# EAGLE design MRCS-Off-Hook-Detector (EAGLE 7.7.0)
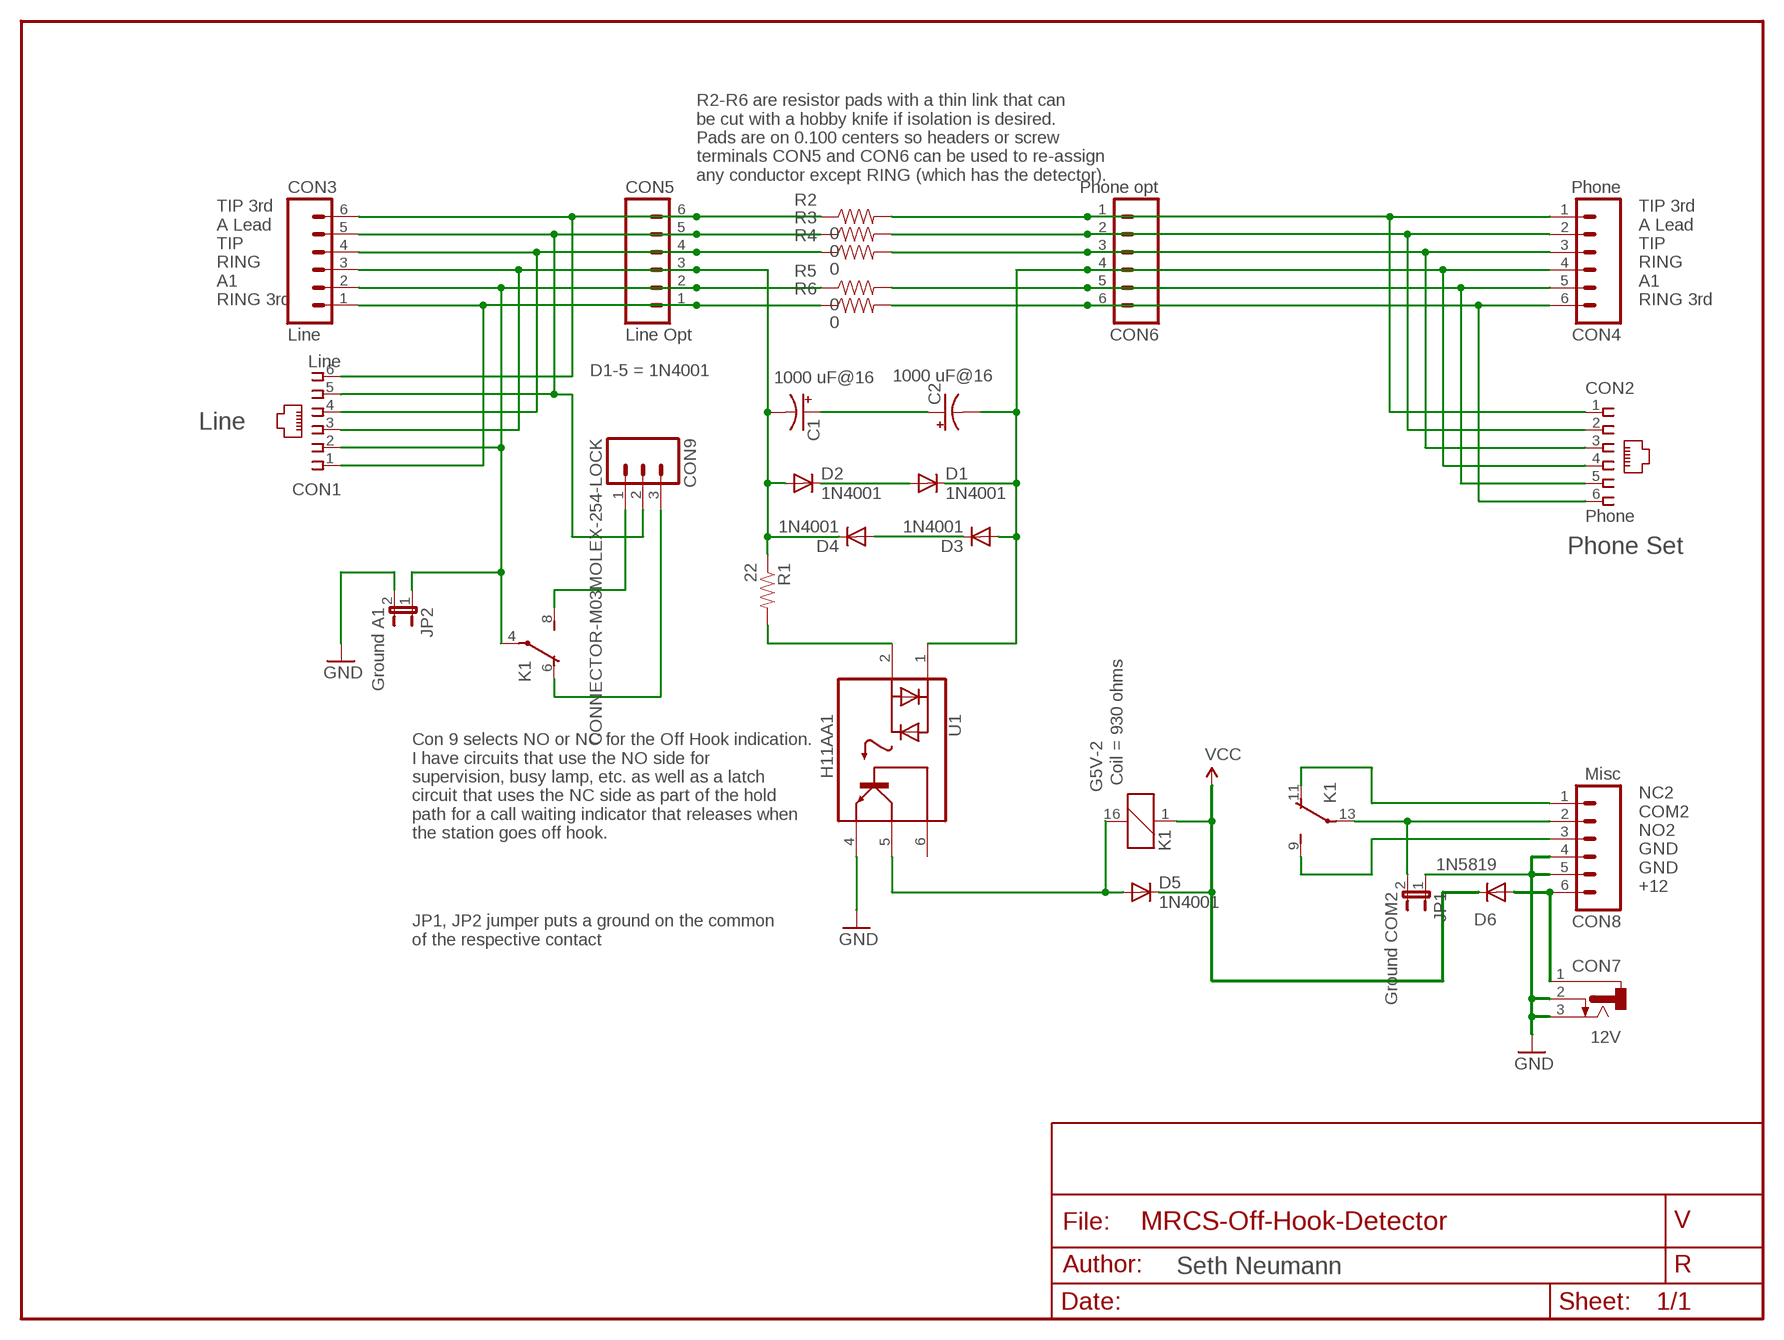
[diagram p0: schematic, sheet 1]

## Parts
C1  1000 uF@16  CPOL-USE3.5-8  [E3,5-8]
C2  1000 uF@16  CPOL-USE3.5-8  [E3,5-8]
CON1  Line  CONNECTOR-RJ25-43860-2-MOLEX  [RJ25-INVERTED]
CON2  Phone  CONNECTOR-RJ25-43860-2-MOLEX  [RJ25-INVERTED]
CON3  Line  CONNECTOR-M06LOCK  [1X06_LOCK]
CON4  Phone  CONNECTOR-M06LOCK  [1X06_LOCK]
CON5  Line Opt  CONNECTOR-M06LOCK  [1X06_LOCK]
CON6  Phone opt  CONNECTOR-M06LOCK  [1X06_LOCK]
CON7  12V  CONNECTOR-DC-POWER-RA  [DCJ0202]
CON8  Misc  CONNECTOR-M06LOCK  [1X06_LOCK]
CON9  CONNECTOR-M03MOLEX-254-LOCK  [MOLEX-1X3_LOCK]
D1  1N4001  DIODEPTH  [DIODE-1N4001]
D2  1N4001  DIODEPTH  [DIODE-1N4001]
D3  1N4001  DIODEPTH  [DIODE-1N4001]
D4  1N4001  DIODEPTH  [DIODE-1N4001]
D5  1N4001  DIODEPTH  [DIODE-1N4001]
D6  1N5819  DIODEPTH  [DIODE-1N4001]
JP1  Ground COM2  JUMPER-2PTH  [1X02]
JP2  Ground A1  JUMPER-2PTH  [1X02]
K1  G5V-2  [G5V-2]
R1  22  RPTH04  [AXIAL-0.4-RES]
R2  0  RPTH-R0  [CUT-R]
R3  0  RPTH-R0  [CUT-R]
R4  0  RPTH-R0  [CUT-R]
R5  0  RPTH-R0  [CUT-R]
R6  0  RPTH-R0  [CUT-R]
U1  H11AA1  [DIP762W50P254L730H410Q6]

## Nets
3RL [Phone]: CON1.1 CON3.1 CON5.1 R6.P2
3RS [Phone]: CON2.6 CON4.6 CON6.6 R6.P1
3TL [Phone]: CON1.6 CON3.6 CON5.6 R2.P2
3TS [Phone]: CON2.1 CON4.1 CON6.1 R2.P1
+12 [Power]: CON7.1 CON8.6 D6.A
A1_LINE [Phone]: CON1.2 CON3.2 CON5.2 JP2.1 K1.4(1:P) R5.P2
A1_PHONE: CON2.5 CON4.5 CON6.5 R5.P1
A_LINE [Phone]: CON1.5 CON3.5 CON5.5 CON9.2 R3.P2
A_PHONE [Phone]: CON2.2 CON4.2 CON6.2 R3.P1
GND: CON7.2 CON7.3 CON8.4 CON8.5 JP1.1 JP2.2 U1.4(E)
N$1: D5.A K1.16 U1.5(C)
N$2: R1.P$2 U1.2(C/A)
N$3: CON8.1 K1.11(2:O)
N$4: D1.A D2.C
N$5: C1.+ C2.+
N$6: D3.C D4.A
N$7: CON9.1 K1.8(1:S)
N$9: CON9.3 K1.6(1:O)
N$15: CON8.2 JP1.2 K1.13(2:P)
N$16: CON8.3 K1.9(2:S)
RING-PHONE [Phone]: C2.- CON2.4 CON4.4 CON6.4 D1.C D3.A U1.1(A/C)
RING_LINE: C1.- CON1.3 CON3.3 CON5.3 D2.A D4.C R1.P$1
TIP_LINE [Phone]: CON1.4 CON3.4 CON5.4 R4.P2
TIP_PHONE: CON2.3 CON4.3 CON6.3 R4.P1
VCC [Power]: D5.C D6.C K1.1
Unconnected: U1.6(B)

## Notes on the sheet
- R2-R6 are resistor pads with a thin link that can 
  be cut with a hobby knife if isolation is desired. 
  Pads are on 0.100 centers so headers or screw
  terminals CON5 and CON6 can be used to re-assign
  any conductor except RING (which has the detector).
- TIP 3rd
  A Lead
  TIP
  RING
  A1
  RING 3rd
- TIP 3rd
  A Lead
  TIP
  RING
  A1
  RING 3rd
- D1-5 = 1N4001
- Line
- Phone Set
- Coil = 930 ohms
- Con 9 selects NO or NC for the Off Hook indication. 
  I have circuits that use the NO side for
  supervision, busy lamp, etc. as well as a latch
  circuit that uses the NC side as part of the hold 
  path for a call waiting indicator that releases when
  the station goes off hook.
- NC2
  COM2
  NO2
  GND
  GND
  +12
- JP1, JP2 jumper puts a ground on the common
  of the respective contact
- Seth Neumann

## Library data of the parts
C1 C2 = rcl:CPOL-US: POLARIZED CAPACITOR, American symbol
CON1 CON2 = SPCoast:CONNECTOR-RJ25: AMP connector
CON3-CON6 CON8 = SPCoast:CONNECTOR-M06: Header 6 Standard 6-pin 0.1" header
CON7 = SPCoast:CONNECTOR-DC-POWER: DC POWER JACK
CON9 = SPCoast:CONNECTOR-M03
D1-D6 = SPCoast:DIODE: Diode These are standard reverse protection diodes and small signal diodes. SMA package can handle up to about 1A. SOD-323 can handle about 200mA. What the SOD-323 package when ordering, there are some mfgs out there that are 5-pin packages.
JP1 JP2 = SPCoast:JUMPER-2: Jumper Basic 0.1" spaced jumper. Use with breakaway headers.
K1 = relay:G5V-2: OMRON PCB Relay Source: http://www.omron.com/ecb/products/pdf/en-g5v2.pdf; MPN: G5V-2 5DC; OC_FARNELL: 9949488; OC_NEWARK: 78K5703
R1-R6 = SPCoast:R*: Resistor Basic schematic elements and footprints for 0603, 1206, and PTH 1/10th watt (small) resistors.
U1 = MRCS1:H11AA1; AVAILABILITY: Unavailable; DESCRIPTION: Optoisolator Transistor with Base Output 5300Vrms 1 Channel 6-DIP; DIGIKEY-PURCHASE-URL: https://snapeda.com/shop?store=DigiKey&id=925926; MF: Vishay; MP: H11AA1; PACKAGE: DIP-6 Vishay; PRICE: None

## Net classes
0 default: width 0.254 mm, clearance 0.254 mm
1 Power: width 0.406 mm, clearance 0.254 mm
2 Phone: width 0.305 mm, clearance 0.381 mm
3 Nasty Loads: width 0.61 mm, clearance 0.61 mm

## Board
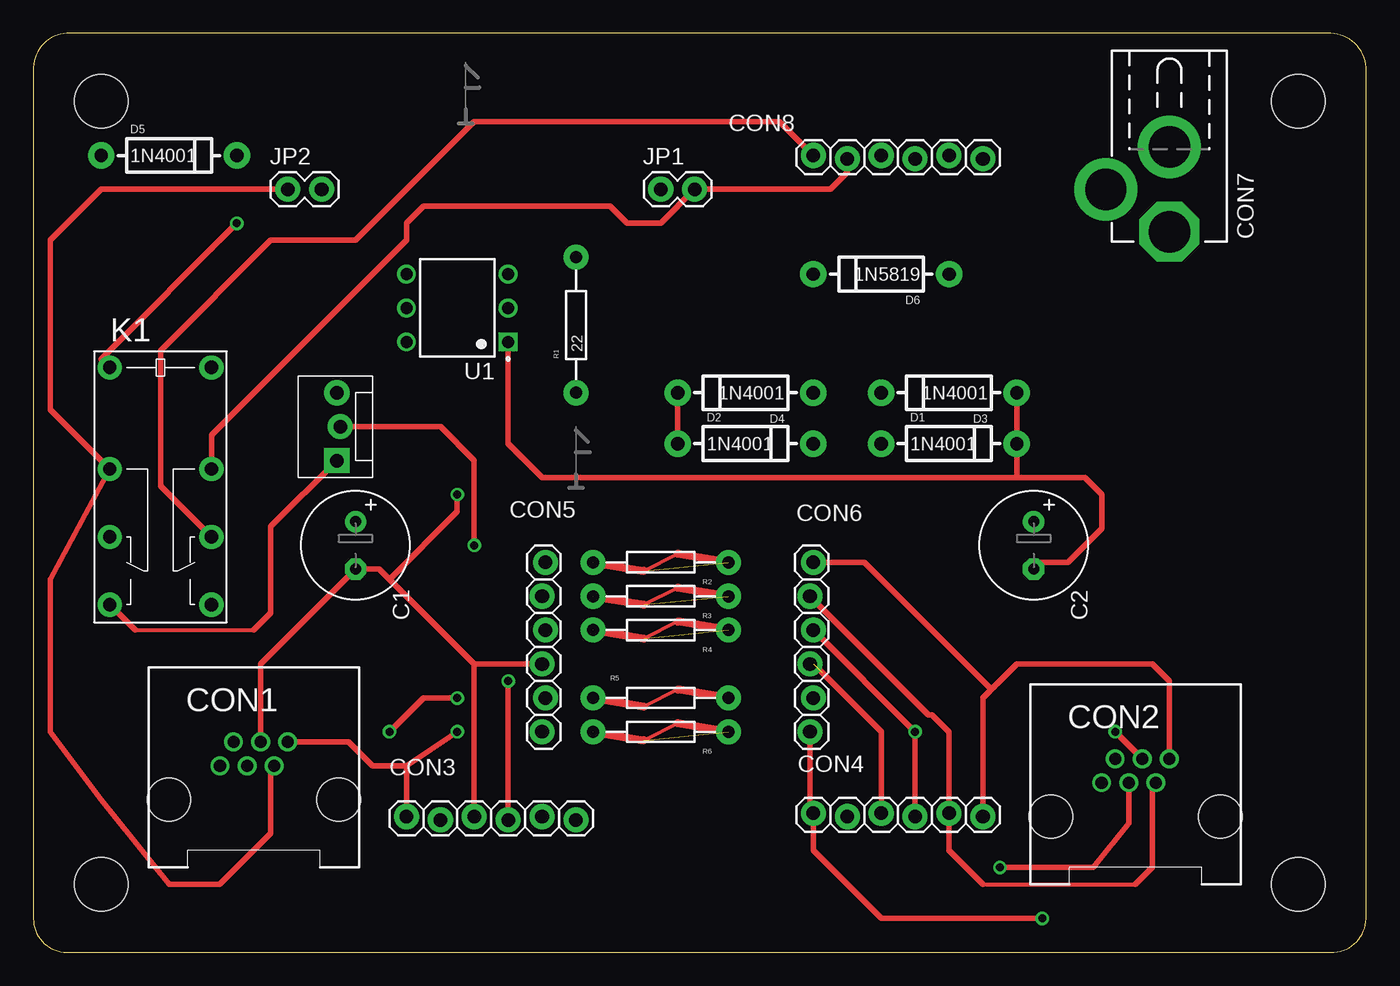
[diagram p1: board, top side]
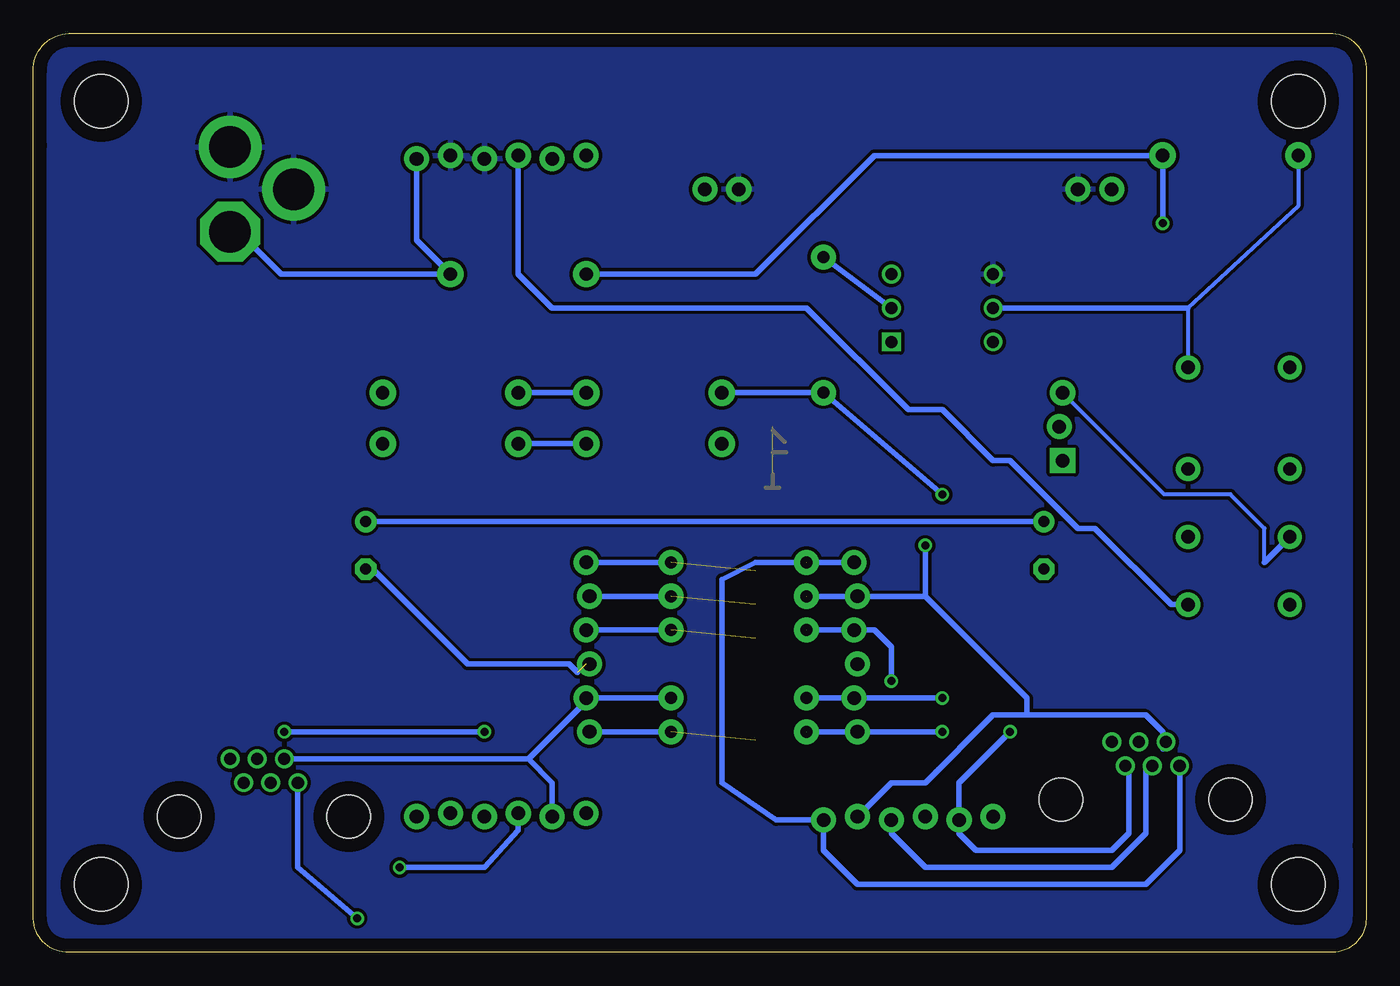
[diagram p2: board, bottom side, seen from below]

Size 99.82 x 68.83 mm. Coordinates in mm from the lower left corner, seen from the top.
Copper layers (1*16): Top 0.035mm / dielectric 1.5mm / Bottom 0.035mm
Design rules "default": minimum track width 10mil, minimum drill 0.6mm, track to track 8mil, track to pad 8mil, pad to pad 8mil, via to via 8mil, smd to smd 8mil, copper to edge 40mil, drill to drill 8mil, minimum pad ring 10mil, minimum via ring 8mil, stop-mask expansion 4mil, vias tented up to drill 0mil, thermal gap 10mil

### Footprints (pad centres in the part's own frame; a part is rotated, then mirrored left to right if it is on the bottom)
E3,5-8 = drill 0.813 pad 1.6: + -1.778,0 | drill 0.813 pad 1.6 octagon: - 1.778,0
RJ25-INVERTED = drill 0.9 pad 1.4: 1 2.54,4.318; 2 1.524,2.54; 3 0.508,4.318; 4 -0.508,2.54; 5 -1.524,4.318; 6 -2.54,2.54 | hole 3.251: -6.35,0; 6.35,0
1X06_LOCK = drill 1.016 pad 1.88: 1 0,0; 2 2.54,-0.254; 3 5.08,0; 4 7.62,-0.254; 5 10.16,0; 6 12.7,-0.254
DCJ0202 = drill 3.1 pad 4.5 octagon: 1 0,3.175 | drill 3.1 pad 4.7: 2 4.763,0; 3 0,-3.175
MOLEX-1X3_LOCK = drill 1.016 pad 1.88 square: 1 0,0.127 | drill 1.016 pad 1.88: 2 2.54,-0.127; 3 5.08,0.127
DIODE-1N4001 = drill 1 pad 1.981: A -5.08,0; C 5.08,0
1X02 = drill 1.016 pad 1.88: 1 0,0; 2 2.54,0
G5V-2 = drill 1 pad 1.8: 1 -8.89,-3.81; 4 -1.27,-3.81; 6 3.81,-3.81; 8 8.89,-3.81; 9 8.89,3.81; 11 3.81,3.81; 13 -1.27,3.81; 16 -8.89,3.81
AXIAL-0.4-RES = drill 0.9 pad 1.88: P$1 -5.08,0; P$2 5.08,0
CUT-R = drill 0.9 pad 1.88: P1 5.08,0; P2 -5.08,0
DIP762W50P254L730H410Q6 = drill 0.9 pad 1.4 square: 1 -3.81,2.54 | drill 0.9 pad 1.4: 2 -3.81,0; 3 -3.81,-2.54; 4 3.81,-2.54; 5 3.81,0; 6 3.81,2.54
BOARD-DINRAIL-2.7IN = hole 4: 94.742,5.08; 5.08,63.754; 94.742,63.754; 5.08,5.08

### Placement (x,y rotation side)
C1  24.13,30.48 270 top
C2  74.93,30.48 270 top
CON1  16.51,11.43 0 top
CON2  82.55,10.16 0 top
CON3  27.94,10.16 0 top
CON4  71.12,10.16 180 top
CON5  38.1,16.51 90 top
CON6  58.42,29.21 270 top
CON7  85.09,57.15 180 top
CON8  58.42,59.69 0 top
CON9  22.86,36.83 90 top
D1  68.58,38.1 0 top
D2  53.34,38.1 0 top
D3  68.58,41.91 180 top
D4  53.34,41.91 180 top
D5  10.16,59.69 0 top
D6  63.5,50.8 180 top
JP1  46.99,57.15 0 top
JP2  19.05,57.15 0 top
K1  9.53,34.92 270 top
R1  40.64,46.99 90 top
R2  46.99,29.21 180 top
R3  46.99,26.67 180 top
R4  46.99,24.13 180 top
R5  46.99,19.05 0 top
R6  46.99,16.51 180 top
U1  31.75,48.26 180 top
U$1  [BOARD-DINRAIL-2.7IN]  0,0 0 top
U$2  [CA-PROP65WARNING]  63.5,45.72 0 top
U$3  [MRCSLOGOBTM]  38.1,34.29 0 top
U$4  [MRCSLOGOTOP]  39.37,34.29 0 top
U$5  [MRCSLOGOTOP]  31.12,61.59 0 top

### Tracks (layer width: path | path; a pad name or v marks a point on that pad's centre or on a via)
3RL  (via drill 0.6)  (1 unrouted)
  Top 0.406: 27.94,13.97 CON3.1 | 27.94,13.97 v31.75,16.51 | CON1.1 23.62,15.75 25.4,13.97 27.94,13.97
  Bottom 0.406: 41.91,16.51 CON5.1 v31.75,16.51
3RS  (via drill 0.6)  (1 unrouted)
  Top 0.406: CON6.6 58.17,10.41 58.42,10.16 CON4.6 58.42,7.62 63.5,2.54 v75.57,2.54
  Bottom 0.406: v75.57,2.54 80.01,6.35 CON2.6 | 58.42,16.51 CON6.6 52.07,16.51
3TL  (1 unrouted)
  Bottom 0.406: 41.91,29.21 CON5.6 45.72,29.21 48.26,27.94 48.26,12.7 44.2,9.91 CON3.6 40.64,7.62 38.1,5.08 16.51,5.08 13.97,7.62 CON1.6
3TS  (1 unrouted)
  Top 0.406: CON4.1 71.12,19.05 71.76,19.68 | 71.76,19.68 73.66,21.59 83.82,21.59 85.09,20.32 CON2.1 | CON6.1 62.23,29.21 71.76,19.68
  Bottom 0.406: CON6.1 52.07,29.21
+12
  Bottom 0.406: CON7.1 84.46,53.98 81.28,50.8 D6.A 71.12,53.34 CON8.6
A1_LINE  (via drill 0.6)
  Top 0.406: v26.67,16.51 29.21,19.05 v31.75,19.05 | CON1.2 17.78,13.97 17.78,8.89 13.97,5.08 10.16,5.08 5.08,11.43 1.27,16.51 1.27,27.94 K1.4 1.27,40.64 1.27,53.34 5.08,57.15 JP2.1
  Bottom 0.406: R5.P2 CON5.2 v31.75,19.05 | CON1.2 17.78,13.97 17.78,8.89 19.05,7.62 29.21,7.62 30.48,8.89 CON3.2 30.48,12.7 v26.67,16.51
A1_PHONE
  Bottom 0.406: CON2.5 62.74,14.48 | 62.74,14.48 60.96,12.7 CON4.5 | 62.74,14.48 58.42,18.8 CON6.5 R5.P1
A_LINE  (via drill 0.6)  (1 unrouted)
  Top 0.406: CON9.2 30.48,39.37 33.02,36.83 v33.02,30.48
  Bottom 0.406: 41.91,26.67 CON5.5 33.02,26.67 | CON1.5 15.24,15.24 15.24,16.51 16.51,17.78 25.4,17.78 | 25.4,17.78 27.94,17.78 33.02,12.7 35.56,12.7 CON3.5 | 33.02,26.67 25.4,19.05 25.4,17.78 | v33.02,30.48 33.02,26.67
A_PHONE  (1 unrouted)
  Top 0.305: 71.12,5.08 82.55,5.08
  Top 0.406: 71.12,5.08 68.58,7.62 CON4.2 68.58,16.51 67.31,17.78 67.06,17.78 CON6.2 | 82.55,5.08 83.82,6.35 83.82,12.45 CON2.2
  Bottom 0.406: CON6.2 52.07,26.67
GND
  pour Bottom: 0,0 100.33,0 100.33,68.58 0,68.58
N$1
  Bottom 0.305: D5.A 5.08,55.88 13.34,48.26 K1.16
  Bottom 0.406: 13.34,48.26 U1.5
N$2
  Bottom 0.406: R1.P$2 U1.2
N$3
  Top 0.406: K1.11 9.53,34.92 9.53,45.09 17.78,53.34 24.13,53.34 33.02,62.23 55.88,62.23 CON8.1
N$4
  Bottom 0.406: D1.A D2.C
N$5
  Bottom 0.406: C1.+ C2.+
N$6
  Bottom 0.406: D3.C D4.A
N$7
  Top 0.305: 7.62,24.13 16.51,24.13
  Top 0.406: 16.51,24.13 17.78,25.4 17.78,31.88 CON9.1 | K1.8 7.62,24.13
N$9
  Bottom 0.305: 7.62,29.21 7.62,31.75 10.16,34.29 15.12,34.29 CON9.3
  Bottom 0.406: K1.6 7.62,29.21
N$15
  Top 0.406: CON8.2 60.96,58.42 59.69,57.15 JP1.2 46.99,54.61 44.45,54.61 43.18,55.88 29.21,55.88 27.94,54.61 27.94,53.34 13.34,38.73 K1.13
N$16
  Bottom 0.406: CON8.3 63.5,50.8 60.96,48.26 41.91,48.26 34.29,40.64 31.75,40.64 27.94,36.83 26.67,36.83 21.59,31.75 20.32,31.75 14.61,26.04 K1.9
RING-PHONE  (via drill 0.6)  (1 unrouted)
  Top 0.406: CON6.4 58.42,21.59 63.5,16.51 CON4.4 | CON2.4 82.04,9.65 79.38,6.35 v72.39,6.35 | D3.A D1.C 73.66,35.56 | 73.66,35.56 38.1,35.56 35.56,38.1 U1.1 | C2.- 74.93,29.21 77.47,29.21 80.01,31.75 80.01,34.29 78.74,35.56 73.66,35.56
  Bottom 0.406: v72.39,6.35 66.04,6.35 63.5,9.14 CON4.4 | C2.- 74.42,28.7 67.31,21.59 59.69,21.59 59.06,20.95
RING_LINE  (via drill 0.6)
  Top 0.406: CON1.3 17.02,21.59 C1.- 25.91,28.7 26.67,27.94 | 26.67,27.94 33.02,21.59 | 33.02,21.59 CON5.3 | 33.02,21.59 CON3.3 | D4.C D2.A | 26.67,27.94 31.75,33.02 v31.75,34.29
  Bottom 0.406: v31.75,34.29 R1.P$1 D4.C
TIP_LINE  (via drill 0.6)  (1 unrouted)
  Top 0.406: v35.56,20.32 CON3.4
  Bottom 0.406: 41.91,24.13 CON5.4 36.83,24.13 35.56,22.86 v35.56,20.32 | CON1.4 16.51,13.97 16.51,8.89 19.05,6.35 33.02,6.35 35.56,8.89 CON3.4 35.56,10.16
TIP_PHONE  (via drill 0.6)  (1 unrouted)
  Top 0.406: CON4.3 v66.04,16.51 CON6.3 | v81.03,16.51 CON2.3
  Bottom 0.406: v66.04,16.51 v81.03,16.51 | CON6.3 52.07,24.13
VCC  (via drill 0.6)
  Top 0.406: K1.1 5.08,44.45 v15.24,54.61
  Bottom 0.406: D6.C 45.72,50.8 36.83,59.69 D5.C v15.24,54.61

### Text on the board
tDocu: N C N G G + / C O O N N 1 / 2 M 2 D D 2 | NC / A1 COM / NO | 3T / A / TIP / RING / A1 / 3R | Off Hook Detector / Version 1.1 / Seth Neumann, / Clint Gilliland / July 14, 2020 | 3 A R T A 3 / R 1 I I T / N P / G | 3 A R T A 3 / R 1 I I T / N P / G